# EAGLE design BatebitControllerShieldv0.2.0 (EAGLE 9.5.2)
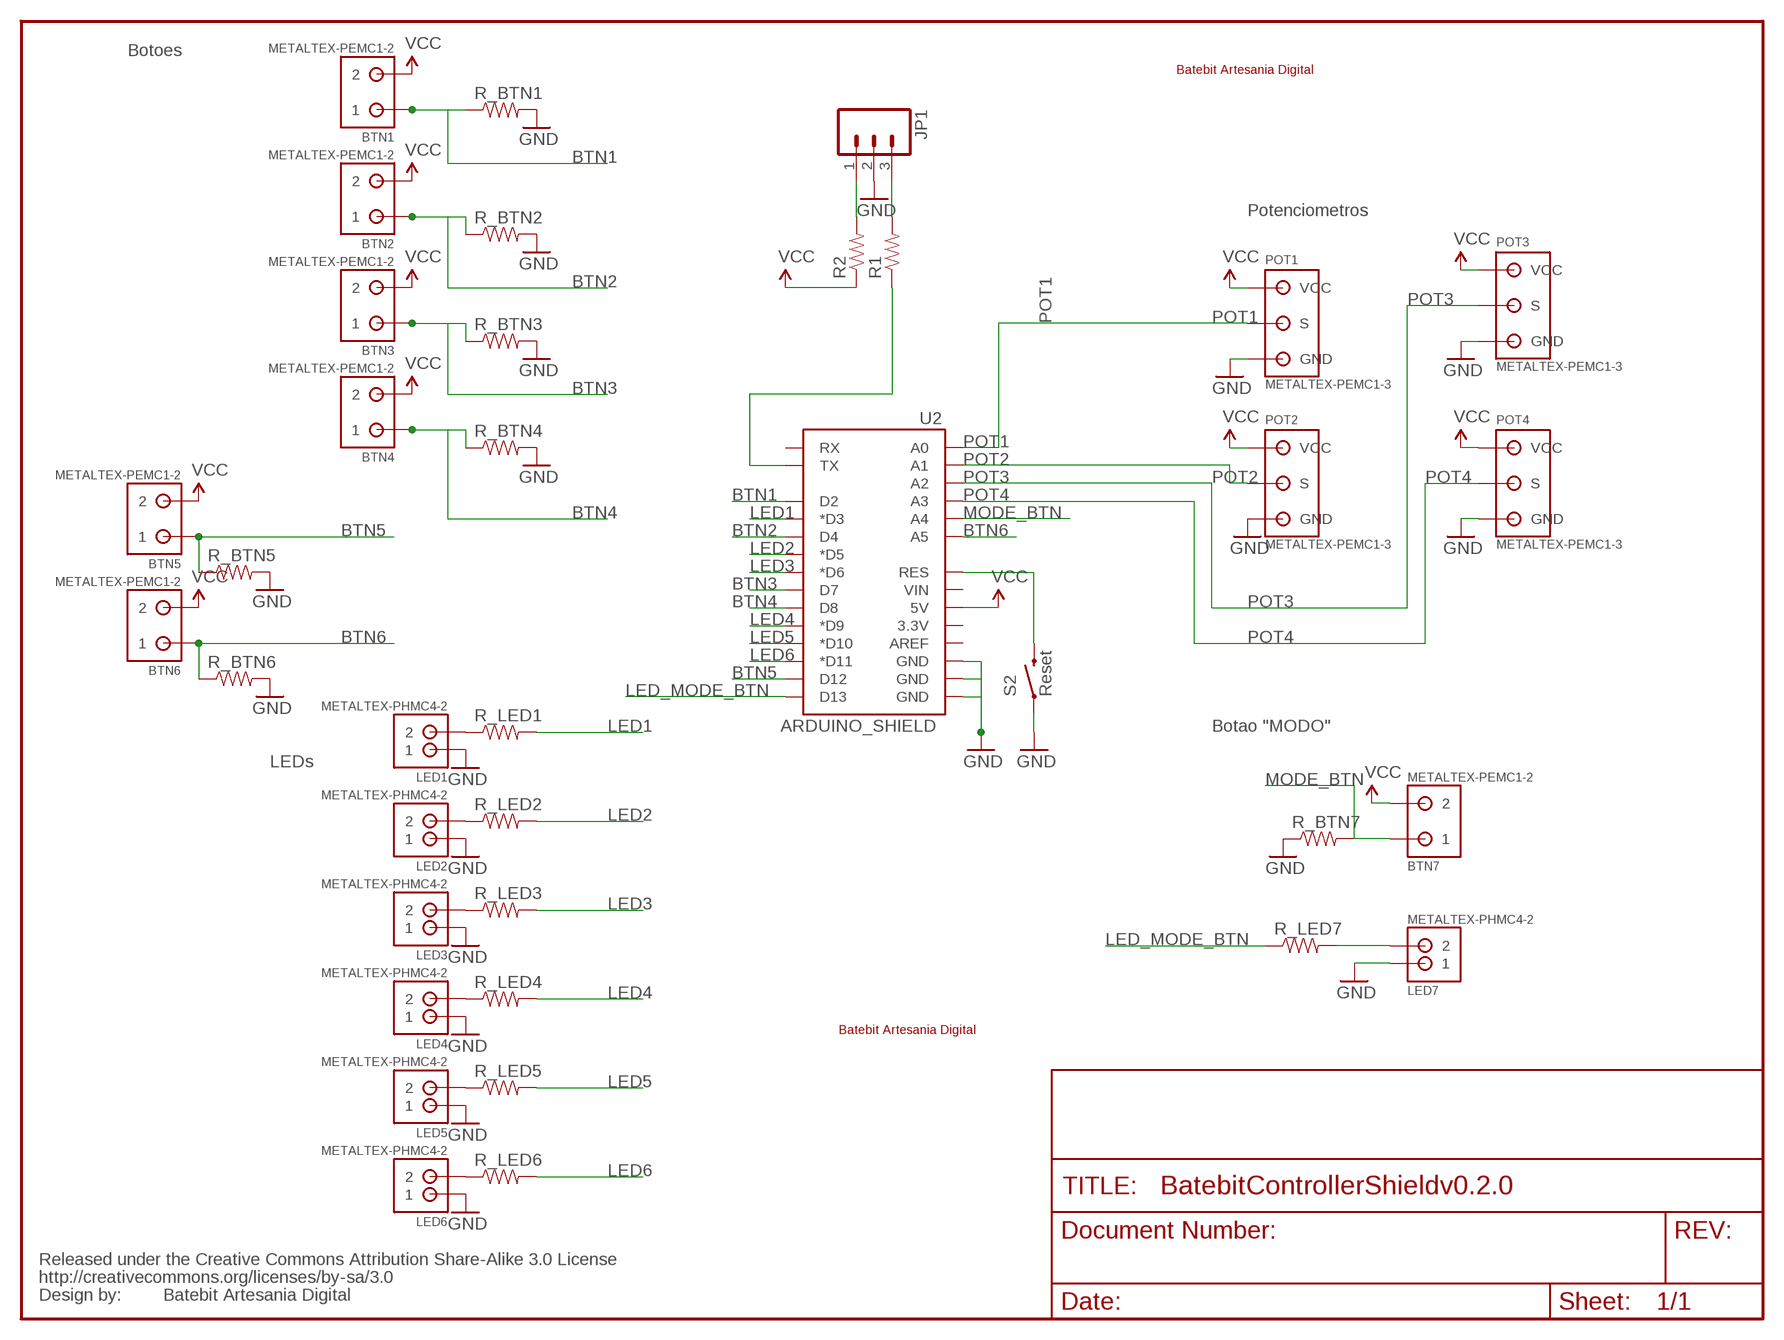
[diagram p0: schematic, sheet 1]

## Parts
BTN1  METALTEX-PEMC1-2  [METALTEX-PEMC1-2-PACKAGE-LONG-PAD]
BTN2  METALTEX-PEMC1-2  [METALTEX-PEMC1-2-PACKAGE-LONG-PAD]
BTN3  METALTEX-PEMC1-2  [METALTEX-PEMC1-2-PACKAGE-LONG-PAD]
BTN4  METALTEX-PEMC1-2  [METALTEX-PEMC1-2-PACKAGE-LONG-PAD]
BTN5  METALTEX-PEMC1-2  [METALTEX-PEMC1-2-PACKAGE-LONG-PAD]
BTN6  METALTEX-PEMC1-2  [METALTEX-PEMC1-2-PACKAGE-LONG-PAD]
BTN7  METALTEX-PEMC1-2  [METALTEX-PEMC1-2-PACKAGE-LONG-PAD]
JP1  M03LONGPADS  [1X03_LONGPADS]
LED1  METALTEX-PHMC4-2  [METALTEX-PHMC4-2-PACKAGE-LONG-PAD]
LED2  METALTEX-PHMC4-2  [METALTEX-PHMC4-2-PACKAGE-LONG-PAD]
LED3  METALTEX-PHMC4-2  [METALTEX-PHMC4-2-PACKAGE-LONG-PAD]
LED4  METALTEX-PHMC4-2  [METALTEX-PHMC4-2-PACKAGE-LONG-PAD]
LED5  METALTEX-PHMC4-2  [METALTEX-PHMC4-2-PACKAGE-LONG-PAD]
LED6  METALTEX-PHMC4-2  [METALTEX-PHMC4-2-PACKAGE-LONG-PAD]
LED7  METALTEX-PHMC4-2  [METALTEX-PHMC4-2-PACKAGE-LONG-PAD]
POT1  METALTEX-PEMC1-3  [METALTEX-PEMC1-3-PACKAGE-LONG-PAD]
POT2  METALTEX-PEMC1-3  [METALTEX-PEMC1-3-PACKAGE-LONG-PAD]
POT3  METALTEX-PEMC1-3  [METALTEX-PEMC1-3-PACKAGE-LONG-PAD]
POT4  METALTEX-PEMC1-3  [METALTEX-PEMC1-3-PACKAGE-LONG-PAD]
R1  RESISTOR0805-RES  [0805]
R2  RESISTOR0805-RES  [0805]
R_BTN1  RESISTOR0805-RES  [0805]
R_BTN2  RESISTOR0805-RES  [0805]
R_BTN3  RESISTOR0805-RES  [0805]
R_BTN4  RESISTOR0805-RES  [0805]
R_BTN5  RESISTOR0805-RES  [0805]
R_BTN6  RESISTOR0805-RES  [0805]
R_BTN7  RESISTOR0805-RES  [0805]
R_LED1  RESISTOR0805-RES  [0805]
R_LED2  RESISTOR0805-RES  [0805]
R_LED3  RESISTOR0805-RES  [0805]
R_LED4  RESISTOR0805-RES  [0805]
R_LED5  RESISTOR0805-RES  [0805]
R_LED6  RESISTOR0805-RES  [0805]
R_LED7  RESISTOR0805-RES  [0805]
S2  Reset  SWITCH-MOMENTARY-2SMD  [TACTILE_SWITCH_SMD]
U2  ARDUINO_SHIELD  ARDUINO_SHIELDLABEL  [DUEMILANOVE_SHIELD]
U$1  BATEBITP  [BATEBIT_BRASAO_P]
U$2  BATEBITMED  [BATEBIT_MED]
U$3  CREATIVE_COMMONS  [CREATIVE_COMMONS]

## Nets
ARST: S2.3 U2.RES
BTN1: BTN1.1 R_BTN1.1 U2.D2
BTN2: BTN2.1 R_BTN2.1 U2.D4
BTN3: BTN3.1 R_BTN3.1 U2.D7
BTN4: BTN4.1 R_BTN4.1 U2.D8
BTN5: BTN5.1 R_BTN5.1 U2.D12
BTN6: BTN6.1 R_BTN6.1 U2.A5
GND: JP1.2 LED1.P1 LED2.P1 LED3.P1 LED4.P1 LED5.P1 LED6.P1 LED7.P1 POT1.1(GND) POT2.1(GND) POT3.1(GND) POT4.1(GND) R_BTN1.2 R_BTN2.2 R_BTN3.2 R_BTN4.2 R_BTN5.2 R_BTN6.2 R_BTN7.1 S2.1 U2.GND@0(GND) U2.GND@1(GND) U2.GND@2(GND)
LED: LED7.P2 R_LED7.2
LED1: R_LED1.2 U2.D3(*D3)
LED2: R_LED2.2 U2.D5(*D5)
LED3: R_LED3.2 U2.D6(*D6)
LED4: R_LED4.2 U2.D9(*D9)
LED5: R_LED5.2 U2.D10(*D10)
LED6: R_LED6.2 U2.D11(*D11)
LED_MODE_BTN: R_LED7.1 U2.D13
MODE_BTN: BTN7.1 R_BTN7.2 U2.A4
N$1: LED1.P2 R_LED1.1
N$2: LED2.P2 R_LED2.1
N$3: LED3.P2 R_LED3.1
N$4: LED4.P2 R_LED4.1
N$5: LED5.P2 R_LED5.1
N$6: LED6.P2 R_LED6.1
N$19: JP1.1 R2.2
N$20: JP1.3 R1.2
N$21: R1.1 U2.TX
POT1: POT1.2(S) U2.A0
POT2: POT2.2(S) U2.A1
POT3: POT3.2(S) U2.A2
POT4: POT4.2(S) U2.A3
VCC: BTN1.2 BTN2.2 BTN3.2 BTN4.2 BTN5.2 BTN6.2 BTN7.2 POT1.3(VCC) POT2.3(VCC) POT3.3(VCC) POT4.3(VCC) R2.1 U2.5V
Unconnected: U2.3.3V U2.AREF U2.RX U2.VIN

## Notes on the sheet
- Botoes
- Potenciometros
- Botao "MODO"
- LEDs
- Batebit Artesania Digital

## Library data of the parts
BTN1-BTN7 = Batebit:METALTEX-PEMC1-2: Metaltex PEMC1-2 (2.54 mm) 2 pin Wire to board connector. Pitch: 2,54 mm, (0.100") Number of pins: 2 Created by Rembrandt Electronics www.rembrandtelectronics.com
JP1 = Batebit:M03: Header 3 Standard 3-pin 0.1" header. Use with straight break away headers (SKU : PRT-00116), right angle break away headers (PRT-00553), swiss pins (PRT-00743), machine pins (PRT-00117), and female headers (PRT-00115). Molex polarized connector foot print use with SKU : PRT-08232 with associated crimp pins and housings.
LED1-LED7 = Batebit:METALTEX-PHMC4-2: Metaltex PHMC4-2 (2.00 mm) 2 pin 2-pin JST PH Shrouded Header, top entry P/N B2B-PH-K-S Mating connector PHR-2 Mating cable assembly: Sparkfun PRT-09914 <http://www.sparkfun.com/products/9914>
POT1-POT4 = Batebit:METALTEX-PEMC1-3: Metaltex PEMC1-2 (2.54 mm) 3 pin Wire to board connector. Pitch: 2,54 mm, (0.100") Number of pins: 3 Created by Batebit
R1 R2 R_BTN1-R_BTN7 R_LED1-R_LED7 = Batebit:RESISTOR: Resistor Basic schematic elements and footprints for 0603, 1206, and PTH resistors.
S2 = SparkFun:SWITCH-MOMENTARY-2
U2 = SparkFun:ARDUINO_SHIELD
U$1 U$2 = Batebit:BATEBIT
U$3 = SparkFun:CREATIVE_COMMONS

## Net classes
0 default: width 0.406 mm, clearance 0.356 mm

## Board
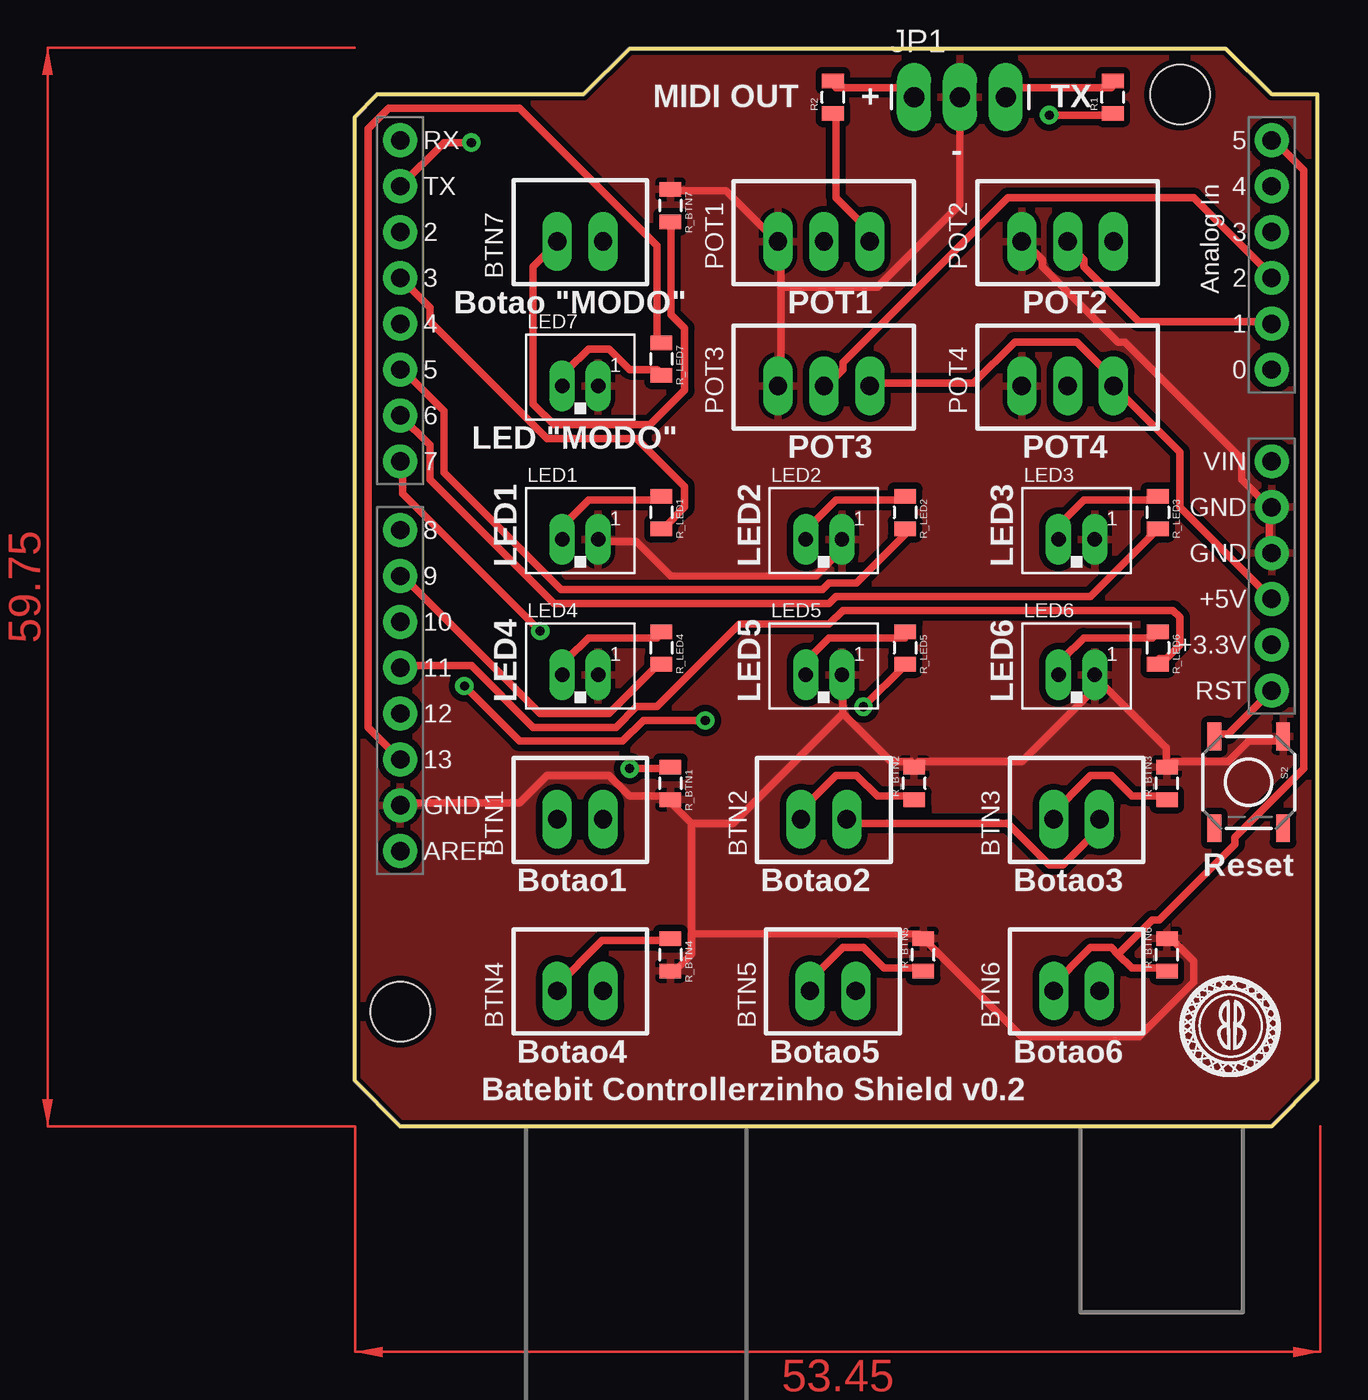
[diagram p1: board, top side]
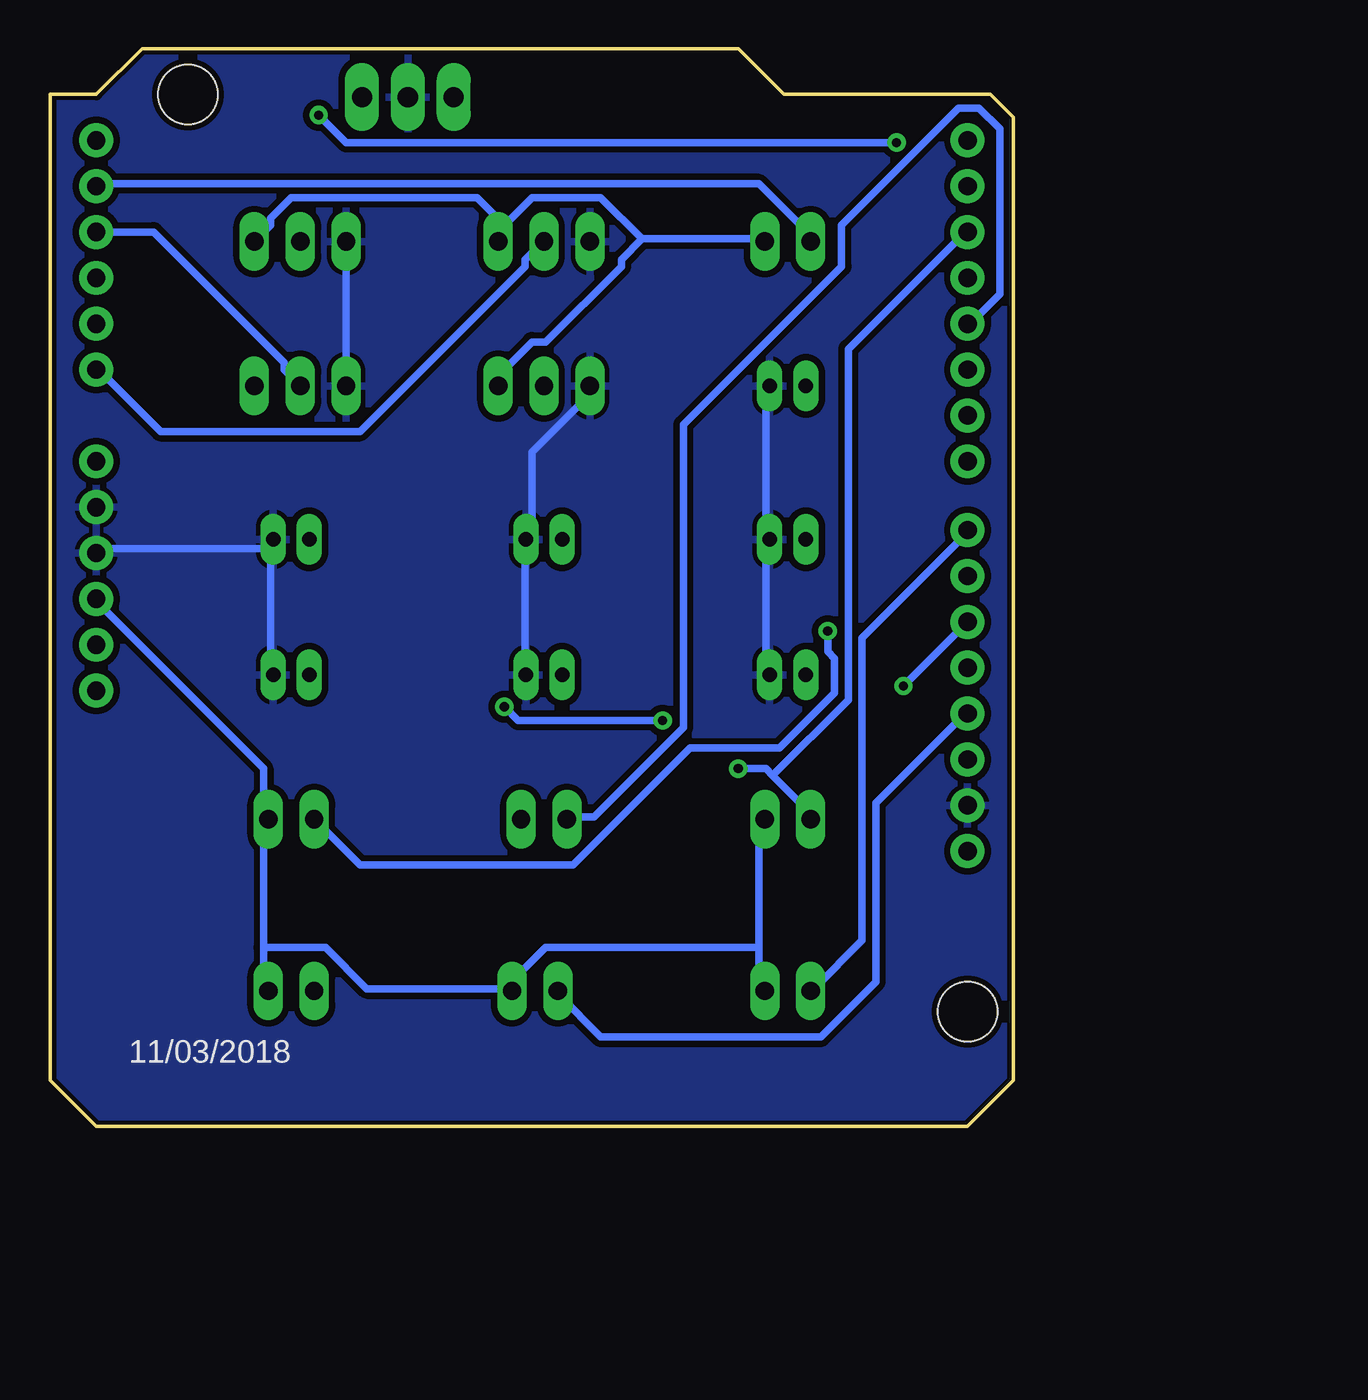
[diagram p2: board, bottom side, seen from below]

Size 53.34 x 59.69 mm. Coordinates in mm from the lower left corner, seen from the top.
Outline: 0,55.88 1.27,57.15 12.7,57.15 15.24,59.69 48.26,59.69 50.8,57.15 53.34,57.15 53.34,2.54 50.8,0 2.54,0 0,2.54 0,55.88
Copper layers (1*16): Top 0.035mm / dielectric 1.5mm / Bottom 0.035mm
Design rules "SparkFun *": minimum track width 8mil, minimum drill 20mil, track to track 8mil, track to pad 8mil, pad to pad 8mil, via to via 8mil, smd to smd 8mil, copper to edge 9mil, drill to drill 7mil, minimum pad ring 12mil, minimum via ring 10mil, stop-mask expansion 4mil, vias tented up to drill 20mil, thermal gap 10mil

### Footprints (pad centres in the part's own frame; a part is rotated, then mirrored left to right if it is on the bottom)
METALTEX-PEMC1-2-PACKAGE-LONG-PAD = drill 1.016 long: 1 -1.27,0; 2 1.27,0
1X03_LONGPADS = drill 1.118 pad 1.88 long: 1 0,0; 2 2.54,0; 3 5.08,0
METALTEX-PHMC4-2-PACKAGE-LONG-PAD = drill 0.8 long: P1 1,-0.5; P2 -1,-0.5
METALTEX-PEMC1-3-PACKAGE-LONG-PAD = drill 1.016 long: 1 -2.54,-0.5; 2 0,-0.5; 3 2.54,-0.5
0805 = smd 0.8 x 1.2: 1 -0.9,0; 2 0.9,0
TACTILE_SWITCH_SMD = smd 1.524 x 0.762: 1 -2.54,1.905; 2 2.54,1.905; 3 -2.54,-1.905; 4 2.54,-1.905
DUEMILANOVE_SHIELD = drill 1.016 pad 1.88: 3.3V 50.8,26.67; 5V 50.8,29.21; A0 50.8,41.91; A1 50.8,44.45; A2 50.8,46.99; A3 50.8,49.53; A4 50.8,52.07; A5 50.8,54.61; AREF 2.54,15.24; D2 2.54,49.53; D3 2.54,46.99; D4 2.54,44.45; D5 2.54,41.91; D6 2.54,39.37; D7 2.54,36.83; D8 2.54,33.02; D9 2.54,30.48; D10 2.54,27.94; D11 2.54,25.4; D12 2.54,22.86; D13 2.54,20.32; GND@0 50.8,31.75; GND@1 50.8,34.29; GND@2 2.54,17.78; RES 50.8,24.13; RX 2.54,54.61; TX 2.54,52.07; VIN 50.8,36.83 | hole 3.302: 45.72,57.15; 2.54,6.35

### Placement (x,y rotation side)
BTN1  12.5,17 0 top
BTN2  26,17 0 top
BTN3  40,17 0 top
BTN4  12.5,7.5 0 top
BTN5  26.5,7.5 0 top
BTN6  40,7.5 0 top
BTN7  12.5,49 0 top
JP1  31,57 0 top
LED1  12.5,33 0 top
LED2  26,33 0 top
LED3  40,33 0 top
LED4  12.5,25.5 0 top
LED5  26,25.5 0 top
LED6  40,25.5 0 top
LED7  12.5,41.5 0 top
POT1  26,49.5 0 top
POT2  39.5,49.5 0 top
POT3  26,41.5 0 top
POT4  39.5,41.5 0 top
R1  42,57 90 top
R2  26.5,57 90 top
R_BTN1  17.5,19 270 top
R_BTN2  31,19 90 top
R_BTN3  45,19 90 top
R_BTN4  17.5,9.5 270 top
R_BTN5  31.5,9.5 90 top
R_BTN6  45,9.5 90 top
R_BTN7  17.5,51 270 top
R_LED1  17,34 270 top
R_LED2  30.5,34 270 top
R_LED3  44.5,34 270 top
R_LED4  17,26.5 270 top
R_LED5  30.5,26.5 270 top
R_LED6  44.5,26.5 270 top
R_LED7  17,42.5 270 top
S2  49.53,19.05 270 top
U2  0,0 0 top
U$1  45.5,2.5 0 top
U$2  26.5,31 0 bottom
U$3  -21.59,60.96 0 top  (outside the outline)

### Tracks (layer width: path | path; a pad name or v marks a point on that pad's centre or on a via)
ARST
  Top 0.406: U2.RES 48.39,21.72 47.62,21.72 S2.3
BTN1  (via drill 0.51)
  Top 0.406: v15.24,19.81 17.14,19.81 R_BTN1.1
  Bottom 0.406: v15.24,19.81 13.72,19.81 13.34,19.43 | 13.34,19.43 11.05,17.14 BTN1.1 | 13.34,19.43 9.14,23.62 9.14,43.05 2.67,49.53 U2.D2
BTN2
  Top 0.406: R_BTN2.1 30.86,18.29 28.96,18.29 27.81,19.43 26.67,19.43 24.38,17.14 BTN2.1
  Bottom 0.406: U2.D4 2.29,44.58 0.76,46.1 0.76,55.24 1.91,56.39 3.05,56.39 9.53,49.91 9.53,47.62 18.29,38.86 18.29,22.1 23.24,17.14 24.38,17.14 BTN2.1
BTN3  (via drill 0.51)
  Top 0.406: R_BTN3.1 44.96,18.29 43.05,18.29 41.91,19.43 40.77,19.43 38.48,17.14 BTN3.1 | v10.29,27.43 2.67,35.05 2.67,36.58 U2.D7
  Bottom 0.406: v10.29,27.43 10.29,26.29 9.91,25.91 9.91,24 12.95,20.95 17.91,20.95 24.38,14.48 36.2,14.48 38.48,16.76 BTN3.1
BTN4
  Top 0.406: R_BTN4.1 17.14,10.29 13.72,10.29 11.05,7.62 BTN4.1
  Bottom 0.406: U2.D8 2.67,32.77 8.38,27.05 8.38,10.29 11.05,7.62 BTN4.1
BTN5
  Top 0.406: R_BTN5.1 31.24,8.76 29.34,8.76 28.19,9.91 27.05,9.91 25.53,8.38 25.53,7.62 BTN5.1
  Bottom 0.406: U2.D12 2.67,22.86 7.62,17.91 7.62,8 10.67,4.95 22.86,4.95 25.15,7.24 BTN5.1
BTN6
  Top 0.406: 42.29,9.53 41.91,9.91 40.77,9.91 38.48,7.62 BTN6.1 | 42.29,9.53 43.05,8.76 44.96,8.76 R_BTN6.1 | 42.29,9.53 44.2,11.43 44.58,11.43 48.77,15.62 48.77,16 52.58,19.81 52.58,52.96 51.05,54.48 U2.A5
GND
  Top 0.406: 18.67,16.76 18.67,10.67 | 18.67,10.67 18.67,9.53 17.91,8.76 17.53,8.76 R_BTN4.2 | 18.67,16.76 17.53,17.91 R_BTN1.2 17.14,18.29 15.24,18.29 14.1,19.43 10.67,19.43 9.14,17.91 2.67,17.91 U2.GND@2 | 18.67,10.67 31.24,10.67 R_BTN5.2 31.62,10.29 36.96,4.95 43.43,4.95 46.48,8 46.48,9.14 45.34,10.29 R_BTN6.2 | 50.67,34.29 50.67,32 U2.GND@0 | S2.1 51.44,21.34 49.53,21.34 48.39,20.19 45.34,20.19 R_BTN3.2 44.96,20.19 44.96,20.95 41.15,24.77 LED6.P1 40.77,24.77 40.77,24 36.96,20.19 31.24,20.19 R_BTN2.2 30.86,20.19 29.72,20.19 27.05,22.86 | 50.67,34.29 49.15,35.81 49.15,36.96 42.67,43.43 42.29,43.43 38.1,47.62 38.1,48.01 37.34,48.77 POT2.1 | 50.67,34.29 U2.GND@1 | 27.05,22.86 27.05,24.77 LED5.P1 | R_BTN7.1 17.53,51.82 20.57,51.82 23.24,49.15 POT1.1 23.62,48.77 23.62,46.48 | 23.62,46.48 23.62,41.15 POT3.1 | 23.62,46.48 28.96,46.48 33.53,51.05 33.53,56.77 JP1.2 | LED1.P1 13.72,32.38 15.62,32.38 17.53,30.48 25.53,30.48 26.67,31.62 26.67,32.38 LED2.P1 | 18.67,16.76 20.95,16.76 27.05,22.86
  Bottom 0.406: POT2.1 36.96,48.77 POT4.1 | 41.15,32 41.15,25.15 LED6.P1 | 41.15,32 41.15,32.38 LED3.P1 41.15,32 | 41.15,32 50.67,32 U2.GND@0 | LED4.P1 13.72,25.15 13.72,32.38 LED1.P1 13.72,32.77 13.72,40.77 LED7.P1 | LED5.P1 27.05,25.15 27.05,32.38 LED2.P1 26.67,32.77 26.67,37.34 23.24,40.77 POT3.1
  pour Bottom: 0,0 0,59.7 53.4,59.7 53.4,0
  pour Top: 0,0 0,59.75 53.5,59.75 53.5,0 0.05,0
LED
  Top 0.406: R_LED7.2 16.76,41.91 15.24,41.91 14.1,43.05 12.95,43.05 11.81,41.91 11.81,41.15 LED7.P2
LED1
  Top 0.406: U2.D3 4.19,45.34 4.19,44.58 10.67,38.1 15.62,38.1 18.29,35.43 18.29,34.29 17.14,33.15 R_LED1.2
LED2
  Top 0.406: R_LED2.2 30.48,32.77 27.81,30.1 26.29,30.1 25.91,29.72 11.43,29.72 4.95,36.2 4.95,39.62 2.67,41.91 U2.D5
LED3
  Top 0.406: U2.D6 4.19,37.72 4.19,35.81 11.05,28.96 26.29,28.96 26.67,29.34 40.77,29.34 44.2,32.77 R_LED3.2
LED4
  Top 0.406: R_LED4.2 16.76,25.53 14.1,22.86 10.29,22.86 2.67,30.48 U2.D9
LED5  (via drill 0.51)
  Top 0.406: v28.19,23.24 30.48,25.53 R_LED5.2 | v19.43,22.48 16,22.48 14.86,21.34 9.14,21.34 v6.1,24.38
  Bottom 0.406: v28.19,23.24 27.43,22.48 v19.43,22.48 | U2.D10 v6.1,24.38
LED6
  Top 0.406: R_LED6.2 44.58,25.91 44.96,25.91 45.72,26.67 45.72,28.19 45.34,28.57 27.05,28.57 26.29,27.81 21.34,27.81 16.76,23.24 15.62,23.24 14.48,22.1 9.91,22.1 6.48,25.53 2.67,25.53 U2.D11
LED_MODE_BTN
  Top 0.406: U2.D13 0.76,22.1 0.76,55.24 1.91,56.39 9.14,56.39 16.76,48.77 16.76,43.43 R_LED7.1
MODE_BTN
  Top 0.406: R_BTN7.2 17.53,49.91 17.53,44.96 18.29,44.2 18.29,40.77 16.38,38.86 11.05,38.86 9.91,40.01 9.91,47.62 11.05,48.77 BTN7.1
  Bottom 0.406: U2.A4 50.67,52.2 14.1,52.2 11.05,49.15 BTN7.1
N$1
  Top 0.406: R_LED1.1 16.76,34.67 12.95,34.67 11.81,33.53 11.81,32.77 LED1.P2
N$2
  Top 0.406: R_LED2.1 30.48,34.67 26.67,34.67 24.77,32.77 LED2.P2
N$3
  Top 0.406: R_LED3.1 44.2,34.67 40.39,34.67 39.24,33.53 39.24,32.77 LED3.P2
N$4
  Top 0.406: R_LED4.1 16.76,27.05 12.95,27.05 11.81,25.91 11.81,25.15 LED4.P2
N$5
  Top 0.406: R_LED5.1 30.48,27.05 26.29,27.05 25.15,25.91 25.15,25.15 LED5.P2
N$6
  Top 0.406: R_LED6.1 44.2,27.05 40.39,27.05 39.24,25.91 39.24,25.15 LED6.P2
N$19
  Top 0.406: R2.2 26.67,57.53 30.48,57.53 30.86,57.15 JP1.1
N$20
  Top 0.406: R1.2 41.91,57.53 36.58,57.53 36.2,57.15 JP1.3
N$21  (via drill 0.51)
  Top 0.406: v38.48,56.01 41.91,56.01 R1.1 | v6.48,54.48 4.95,54.48 U2.TX
  Bottom 0.406: v38.48,56.01 36.96,54.48 v6.48,54.48
POT1
  Bottom 0.406: POT1.2 26.29,48.77 27.05,48.01 27.05,47.62 36.2,38.48 47.24,38.48 50.67,41.91 U2.A0
POT2
  Top 0.406: POT2.2 39.62,48.77 40.39,48.01 40.39,47.62 43.43,44.58 50.67,44.58 U2.A1
POT3
  Top 0.406: POT3.2 26.29,41.15 27.05,41.91 27.05,42.29 36.2,51.44 46.48,51.44 50.67,47.24 U2.A2
POT4
  Bottom 0.406: U2.A3 47.62,49.53 40.39,42.29 40.39,41.91 39.62,41.15 POT4.2
VCC
  Top 0.406: BTN2.2 27.43,16.76 36.2,16.76 38.48,14.48 39.24,14.48 41.53,16.76 BTN3.2 | R2.1 26.67,56.01 26.67,51.44 28.19,49.91 28.19,49.15 POT1.3 | POT3.3 28.57,41.15 34.29,41.15 36.58,43.43 40.01,43.43 42.29,41.15 POT4.3 42.29,40.77 45.72,37.34 45.72,34.29 U2.5V
  Bottom 0.406: 14.1,9.91 14.1,16.76 BTN1.2 | 14.1,9.91 14.1,7.62 BTN4.2 | 14.1,9.91 25.91,9.91 27.43,8.38 27.43,7.62 BTN5.2 27.81,7.62 35.81,7.62 38.1,9.91 41.53,9.91 | 41.53,9.91 41.53,16.76 BTN3.2 41.53,17.14 41.53,19.81 50.67,28.96 U2.5V | 41.53,9.91 41.53,7.62 BTN6.2 | 20.57,49.15 14.1,49.15 BTN7.2 | 20.57,49.15 22.86,51.44 26.67,51.44 28.19,49.91 | 28.19,49.91 28.19,49.15 POT1.3 28.19,49.91 | 28.19,49.91 29.72,51.44 40.01,51.44 41.15,50.29 41.15,49.91 41.91,49.15 POT2.3 | 20.57,49.15 21.72,48.01 21.72,47.62 25.91,43.43 26.67,43.43 28.19,41.91 28.19,41.15 POT3.3
(copper drawn outside any net)
  shapes: Top area x2

### Text on the board
tPlace: MIDI OUT | + | TX | - | Botao "MODO" | POT1 | POT2 | LED "MODO" | POT3 | POT4 | LED1 | LED2 | LED3 | LED4 | LED5 | LED6 | Reset | Botao1 | Botao2 | Botao3 | Botao4 | Botao5 | Botao6 | Batebit Controllerzinho Shield v0.2
bPlace: 11/03/2018